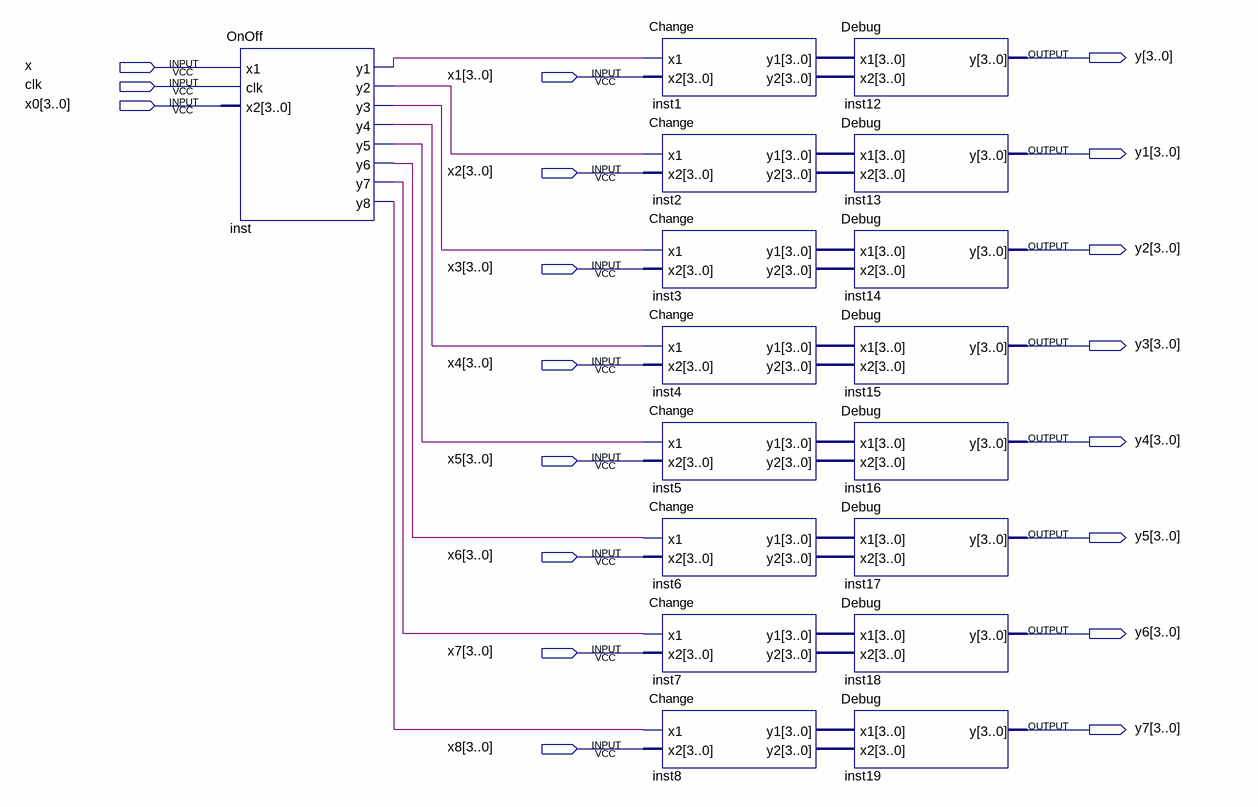
[diagram p0: schematic sheet]
// Quartus schematic SwitchNum.bdf as structural Verilog: 17 symbols, 19 pins
module SwitchNum (
  input  x,
  input  [3:0] x1,
  input  clk,
  input  [3:0] x0,
  input  [3:0] x2,
  input  [3:0] x3,
  input  [3:0] x4,
  input  [3:0] x5,
  input  [3:0] x6,
  input  [3:0] x7,
  input  [3:0] x8,
  output [3:0] y,
  output [3:0] y1,
  output [3:0] y2,
  output [3:0] y3,
  output [3:0] y4,
  output [3:0] y5,
  output [3:0] y6,
  output [3:0] y7
);

  wire inst_y1, inst_y2, inst_y3, inst_y4, inst_y5, inst_y6, inst_y7, inst_y8;
  wire [3:0] inst1_y1, inst1_y2, inst2_y1, inst2_y2, inst3_y1, inst3_y2, inst4_y1, inst4_y2, inst5_y1,
       inst5_y2, inst6_y1, inst6_y2, inst7_y1, inst7_y2, inst8_y1, inst8_y2;

  OnOff inst (
    .x1(x), .clk(clk), .x2(x0), .y1(inst_y1), .y2(inst_y2), .y3(inst_y3), .y4(inst_y4), .y5(inst_y5),
    .y6(inst_y6), .y7(inst_y7), .y8(inst_y8));
  Change inst1 (.x1(inst_y1), .x2(x1), .y1(inst1_y1), .y2(inst1_y2));
  Change inst2 (.x1(inst_y2), .x2(x2), .y1(inst2_y1), .y2(inst2_y2));
  Change inst3 (.x1(inst_y3), .x2(x3), .y1(inst3_y1), .y2(inst3_y2));
  Change inst4 (.x1(inst_y4), .x2(x4), .y1(inst4_y1), .y2(inst4_y2));
  Change inst5 (.x1(inst_y5), .x2(x5), .y1(inst5_y1), .y2(inst5_y2));
  Change inst6 (.x1(inst_y6), .x2(x6), .y1(inst6_y1), .y2(inst6_y2));
  Change inst7 (.x1(inst_y7), .x2(x7), .y1(inst7_y1), .y2(inst7_y2));
  Change inst8 (.x1(inst_y8), .x2(x8), .y1(inst8_y1), .y2(inst8_y2));
  Debug inst12 (.x1(inst1_y1), .x2(inst1_y2), .y(y));
  Debug inst13 (.x1(inst2_y1), .x2(inst2_y2), .y(y1));
  Debug inst14 (.x1(inst3_y1), .x2(inst3_y2), .y(y2));
  Debug inst15 (.x1(inst4_y1), .x2(inst4_y2), .y(y3));
  Debug inst16 (.x1(inst5_y1), .x2(inst5_y2), .y(y4));
  Debug inst17 (.x1(inst6_y1), .x2(inst6_y2), .y(y5));
  Debug inst18 (.x1(inst7_y1), .x2(inst7_y2), .y(y6));
  Debug inst19 (.x1(inst8_y1), .x2(inst8_y2), .y(y7));
endmodule
